# Altium project 724452_RPL-HX_Mobile_AEP_Rev0p91.PrjPcb (part 13 of 13)
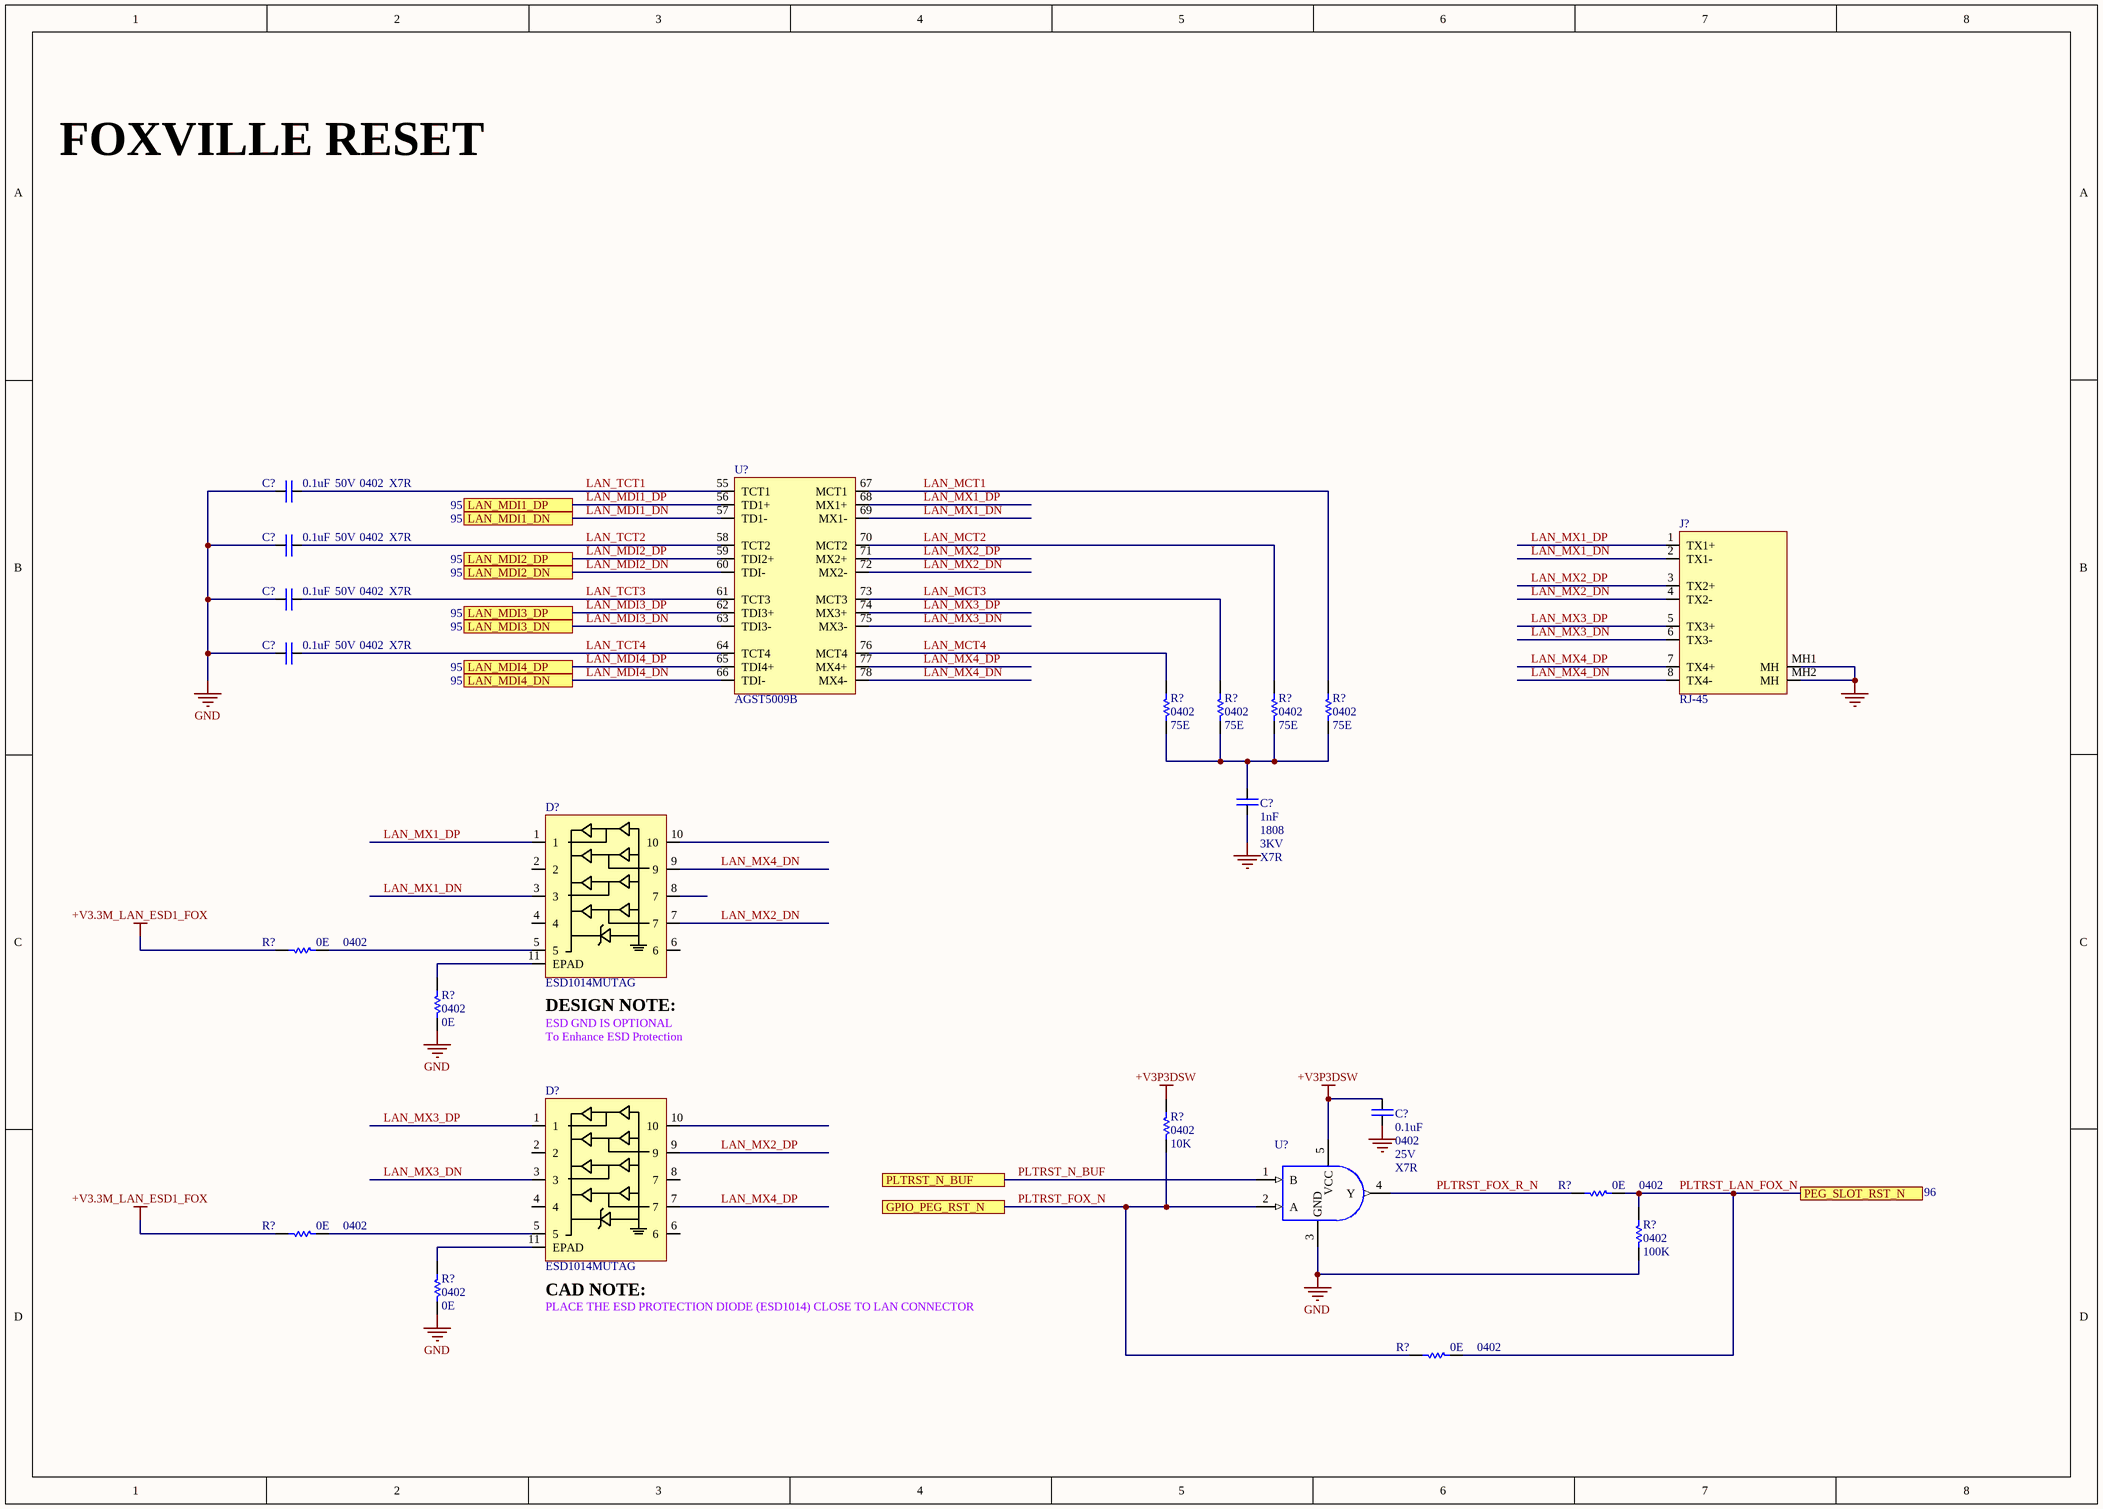
[diagram p163: 0096_CONNECTIVITY - FOX.SchDoc]

## Nets that join several sheets
+V1P8A: 0044_RPL PCH H GPIO OPT (R4409.2), 0045_PCH STRAPS 1 (R?#199.2), 0046_PCH STRAPS 2 (R?#206.2), 0049_GLITCH FREE CIRCUI (R?#235.2), 0059_CAMERA_CONNECTOR (10 pins), 0063_HDMI1_CONNECTOR (R?#341.2), 0093_M.2 KEY-E WLAN-BT (R?#382.2)
+V1P8S: 0047_PCH VALIDATION (R?#221.2 R?#229.2), 0054_eDP_CONNECTOR (Q?#1.1 R?#291.2)
+V3P3A: 0016_Processor - PM , C (R1610.2 R1611.1), 0029_System_debug_conne (R?#54.2 R?#55.2 R?#67.2), 0043_GPP_MUX_E (R?#167.2), 0044_RPL PCH H GPIO OPT (R4406.1), 0052_PCIe_X16 (R?#257.2), 0059_CAMERA_CONNECTOR (6 pins), 0062_HDMI0_CONNECTOR  (R?#312.2 R?#318.2), 0063_HDMI1_CONNECTOR (R?#335.2), 0074_S0IX_REQ_ACK_OPTIO (R7407.1), 0082_USB3 (FB5B1.2), 0084_USB3 (R8401.1 R22221.1), 0091_USB3 (FB9201.2), 0093_M.2 KEY-E WLAN-BT (R?#381.2 R?#386.2 R?#388.2)
+V3P3A_KBC: 0029_System_debug_conne (R?#65.2 R?#66.2), 0074_S0IX_REQ_ACK_OPTIO (R7402.1)
+V3P3DSW: 0029_System_debug_conne (R?#69.2), 0030_DEBUG_CARD_SPI_SIG (D?#2.A), 0044_RPL PCH H GPIO OPT (R?#174.2 R?#177.2), 0046_PCH STRAPS 2 (R?#208.2), 0058_DISPLAY SHIFT-POWE (C2B14.1 R1B3.2 U5801.3), 0095_GBIT LAN - FOXVILLE LAN PHY CHIP (R?#403.1), 0096_CONNECTIVITY - FOX (C?#273.1 R?#430.2 U?#10.5)
+V3P3S: 0034_PCH_CLOCK (6 pins), 0043_GPP_MUX_E (R?#166.2), 0044_RPL PCH H GPIO OPT (C4401.1 U4401.5), 0047_PCH VALIDATION (R?#223.2 R?#226.2), 0052_PCIe_X16 (R?#247.2 R?#249.2 R?#250.2 R?#251.2), 0054_eDP_CONNECTOR (R?#283.2 R?#286.2 R?#294.1 R?#299.2)
+V5A: 0058_DISPLAY SHIFT-POWE (R2A5.1), 0059_CAMERA_CONNECTOR (R5932.1), 0084_USB3 (C8401.1 U8401.4 U8401.5)
+V5A_DDR5: 0024_DDR5 SODIMM CONTRO (C?#80.1 J2301.1 J2301.3), 0026_DDR5 SODIMM CONTRO (7 pins)
+V5A_L: 0062_HDMI0_CONNECTOR  (R?#307.2), 0063_HDMI1_CONNECTOR (R?#330.2), 0084_USB3 (C22113.1 U8402.4 U8402.5)
+V5A_USB_P1: 0083_USB3 (FB8301.2), 0084_USB3 (U8402.1)
+V5A_USB_P2: 0084_USB3 (U8401.1), 0090_USB3 (FB9001.2)
+V5S: 0055_LED CON (C5501.1 R5505.1), 0059_CAMERA_CONNECTOR (R21052.1)
+VCC1P05_PROC: 0016_Processor - PM , C (8 pins), 0017_Processor - MISC (R?#38.2), 0029_System_debug_conne (C?#88.1 R?#62.1), 0031_DEBUG-XDP_SERIES_T (R?#93.2 R?#94.2 R?#95.2 R?#103.2), 0032_DEGUG-JTAG (R?#111.2 R?#112.2 R?#115.2 R?#116.2)
+VCC_CFG_PU_OUT: 0016_Processor - PM , C (6 pins), 0017_Processor - MISC (U?#1.N12), 0029_System_debug_conne (R?#63.2)
+VCC_MPHYPLL_1P8: 0041_PCH_PWR_GND (U?#4.AK22 U?#4.AK23 U?#4.AK25), 0042_PCH_PI_BOM (C7R9.1)
+VCCA_0P82: 0041_PCH_PWR_GND (6 pins), 0042_PCH_PI_BOM (C6R3.1 C6R7.1)
+VCCA_XTAL_PLL_1P8: 0041_PCH_PWR_GND (U?#4.AK16 U?#4.AK18 U?#4.AM16 U?#4.AM18), 0042_PCH_PI_BOM (C7P7.1 C7R5.1 C7R7.1)
+VCCCNVI_LDO_0P4: 0041_PCH_PWR_GND (7 pins), 0042_PCH_PI_BOM (C7E1.1)
+VCCDD2_PROC: 0024_DDR5 SODIMM CONTRO (R?#46.2 R?#48.2), 0026_DDR5 SODIMM CONTRO (R?#51.2)
+VCCDPHY_1P24: 0041_PCH_PWR_GND (U?#4.BF4), 0042_PCH_PI_BOM (C7R1.1)
+VCCHSIO_0P82: 0041_PCH_PWR_GND (30 pins), 0042_PCH_PI_BOM (C6F1.1 C6F2.1 C6F3.1 C7R10.1)
+VCCPDSW_3P3: 0017_Processor - MISC (R?#37.1), 0041_PCH_PWR_GND (U?#4.BE54 U?#4.BF54 U?#4.BF55 U?#4.BG55), 0042_PCH_PI_BOM (C7F1.1)
+VCCPGPPEFK_3P3_1P8_R: 0043_GPP_MUX_E (R?#159.2), 0052_PCIe_X16 (R?#274.2)
+VCCPRIM_1P05: 0041_PCH_PWR_GND (U?#4.AD15), 0042_PCH_PI_BOM (C7R2.1)
+VCCPRIM_1P8: 0041_PCH_PWR_GND (6 pins), 0042_PCH_PI_BOM (5 pins), 0045_PCH STRAPS 1 (R?#185.2), 0046_PCH STRAPS 2 (R?#212.2)
+VCCPRIM_3P3: 0030_DEBUG_CARD_SPI_SIG (R?#90.2), 0041_PCH_PWR_GND (5 pins), 0042_PCH_PI_BOM (C7R12.1 C7R13.1 C7R14.1 C7R15.1), 0043_GPP_MUX_E (R?#157.2 R?#162.2), 0044_RPL PCH H GPIO OPT (R?#176.2 R?#180.2 R?#182.2), 0045_PCH STRAPS 1 (7 pins), 0046_PCH STRAPS 2 (R?#209.2 R?#213.2 R?#216.2)
+VCCPRIMCORE_0P82: 0041_PCH_PWR_GND (13 pins), 0042_PCH_PI_BOM (C6R11.1 C7P8.1)
+VCCPRTC_3P3: 0041_PCH_PWR_GND (5 pins), 0042_PCH_PI_BOM (C7R18.1 C7R19.1)
+VCCRTCEXT: 0041_PCH_PWR_GND (U?#4.AV44), 0042_PCH_PI_BOM (C7F2.1)
+VPROG_3P3: 0029_System_debug_conne (R?#58.2), 0030_DEBUG_CARD_SPI_SIG (11 pins)
+VPROG_3P3_CONN: 0029_System_debug_conne (C?#91.1 J?#4.34), 0030_DEBUG_CARD_SPI_SIG (D?#1.A)
EXP_A_RX_4_DP: 0006_BLOCK DIAGRAM - PO (17 pins), 0012_Processor - PEG, D (U1401.B10 U1401.B12), 0016_Processor - PM , C (5 pins), 0017_Processor - MISC (5 pins), 0021_Processor PD BOM - (62 pins), 0022_Processor - CPU ST (104 pins), 0024_DDR5 SODIMM CONTRO (125 pins), 0026_DDR5 SODIMM CONTRO (129 pins), 0029_System_debug_conne (13 pins), 0030_DEBUG_CARD_SPI_SIG (8 pins), 0031_DEBUG-XDP_SERIES_T (5 pins), 0034_PCH_CLOCK (C?#96.1 C?#97.1 X?#1.2 X?#1.4), 0036_PCH_DMI (R?#151.1), 0037_PCH_PCIe_SATA (R?#152.2 R?#153.2), 0038_PCH_USB (R?#154.1 R?#155.1 R?#156.2), 0041_PCH_PWR_GND (361 pins), 0042_PCH_PI_BOM (28 pins), 0043_GPP_MUX_E (C?#98.2 C?#99.1 C?#100.2 R?#170.1), 0044_RPL PCH H GPIO OPT (8 pins), 0045_PCH STRAPS 1 (11 pins), 0046_PCH STRAPS 2 (6 pins), 0047_PCH VALIDATION (5 pins), 0049_GLITCH FREE CIRCUI (16 pins), 0052_PCIe_X16 (91 pins), 0053_PCIE GEN5_MISC (R?#278.1 SW?#2.4), 0054_eDP_CONNECTOR (28 pins), 0055_LED CON (C5501.2 J5501.2 J5501.MH1 J5501.MH2), 0058_DISPLAY SHIFT-POWE (11 pins), 0059_CAMERA_CONNECTOR (46 pins), 0062_HDMI0_CONNECTOR  (26 pins), 0063_HDMI1_CONNECTOR (28 pins), 0076_TBT_0_PA_CONNECTOR (40 pins), 0077_TBT_0_PB_CONNECTOR (40 pins), 0082_USB3 (22 pins), 0083_USB3 (16 pins), 0084_USB3 (C8401.2 C22113.2 U8401.2 U8402.2), 0090_USB3 (16 pins), 0091_USB3 (22 pins), 0093_M.2 KEY-E WLAN-BT (28 pins), 0095_GBIT LAN - FOXVILLE LAN PHY CHIP (38 pins), 0096_CONNECTIVITY - FOX (12 pins)
VCC: 0006_BLOCK DIAGRAM - PO (17 pins), 0045_PCH STRAPS 1 (R?#192.2), 0095_GBIT LAN - FOXVILLE LAN PHY CHIP (U?#8.8)
CLK_SRC_LAN_CTRL_DN: 0034_PCH_CLOCK (R?#132.2), 0095_GBIT LAN - FOXVILLE LAN PHY CHIP (C?#259.1)
CLK_SRC_LAN_CTRL_DP: 0034_PCH_CLOCK (R?#131.2), 0095_GBIT LAN - FOXVILLE LAN PHY CHIP (C?#258.1)
CLK_SRC_M.2_WLAN_DN: 0034_PCH_CLOCK (R?#135.2), 0093_M.2 KEY-E WLAN-BT (J?#11.49)
CLK_SRC_M.2_WLAN_DP: 0034_PCH_CLOCK (R?#134.2), 0093_M.2 KEY-E WLAN-BT (J?#11.47)
CLK_SRC_PEG_SLOT_DN: 0034_PCH_CLOCK (R?#120.2), 0052_PCIe_X16 (J?#5.A14)
CLK_SRC_PEG_SLOT_DP: 0034_PCH_CLOCK (R?#119.2), 0052_PCIe_X16 (J?#5.A13)
CNV_MFUART2_RXD: 0040_GPP_I_J_K_R_S (U23601.AV12), 0093_M.2 KEY-E WLAN-BT (R?#398.1)
CNV_MFUART2_TXD: 0040_GPP_I_J_K_R_S (U23601.BB4), 0093_M.2 KEY-E WLAN-BT (R?#396.1)
CNV_PA_BLANKING: 0040_GPP_I_J_K_R_S (U23601.BB2), 0093_M.2 KEY-E WLAN-BT (R?#394.1)
CNV_RF_RST_1P8_N: 0039_GPP_C_D_E (U23601.AK4), 0093_M.2 KEY-E WLAN-BT (R?#391.2)
CNV_WR_0_DN: 0036_PCH_DMI (U23601.AW21), 0093_M.2 KEY-E WLAN-BT (R?#377.1)
CNV_WR_0_DP: 0036_PCH_DMI (U23601.BA21), 0093_M.2 KEY-E WLAN-BT (R?#378.1)
CNV_WR_1_DN: 0036_PCH_DMI (U23601.BB18), 0093_M.2 KEY-E WLAN-BT (R?#373.1)
CNV_WR_1_DP: 0036_PCH_DMI (U23601.BD17), 0093_M.2 KEY-E WLAN-BT (R?#375.1)
CNV_WR_CLK_DN: 0036_PCH_DMI (U23601.AW19), 0093_M.2 KEY-E WLAN-BT (R?#379.1)
CNV_WR_CLK_DP: 0036_PCH_DMI (U23601.BA18), 0093_M.2 KEY-E WLAN-BT (R?#380.1)
CNV_WT_0_DN: 0036_PCH_DMI (U23601.BF18), 0093_M.2 KEY-E WLAN-BT (J?#11.67)
CNV_WT_0_DP: 0036_PCH_DMI (U23601.BG18), 0093_M.2 KEY-E WLAN-BT (J?#11.65)
CNV_WT_1_DN: 0036_PCH_DMI (U23601.BF19), 0093_M.2 KEY-E WLAN-BT (J?#11.61)
CNV_WT_1_DP: 0036_PCH_DMI (U23601.BE19), 0093_M.2 KEY-E WLAN-BT (J?#11.59)
CNV_WT_CLK_DN: 0036_PCH_DMI (U23601.BF17), 0093_M.2 KEY-E WLAN-BT (J?#11.73)
CNV_WT_CLK_DP: 0036_PCH_DMI (U23601.BG17), 0093_M.2 KEY-E WLAN-BT (J?#11.71)
CNVI_CLKREQ_1P8_N: 0039_GPP_C_D_E (U23601.AJ2), 0093_M.2 KEY-E WLAN-BT (R?#392.2)
CPU_RTCCLK: 0017_Processor - MISC (R?#41.2 R?#42.2 U?#1.N8), 0034_PCH_CLOCK (R?#150.2)
DDIA_AUX_DN: 0013_Processor - DISPLA (U1401.D35), 0054_eDP_CONNECTOR (C?#159.2 R?#303.2)
DDIA_AUX_DP: 0013_Processor - DISPLA (U1401.E35), 0054_eDP_CONNECTOR (C?#157.2 R?#302.2)
DDIA_TX0_DN: 0013_Processor - DISPLA (U1401.E34), 0054_eDP_CONNECTOR (C?#162.2)
DDIA_TX0_DP: 0013_Processor - DISPLA (U1401.F34), 0054_eDP_CONNECTOR (C?#161.2)
DDIA_TX1_DN: 0013_Processor - DISPLA (U1401.D33), 0054_eDP_CONNECTOR (C?#160.2)
DDIA_TX1_DP: 0013_Processor - DISPLA (U1401.E33), 0054_eDP_CONNECTOR (C?#158.2)
DDIA_TX2_DN: 0013_Processor - DISPLA (U1401.E32), 0054_eDP_CONNECTOR (C?#156.2)
DDIA_TX2_DP: 0013_Processor - DISPLA (U1401.F32), 0054_eDP_CONNECTOR (C?#155.2)
DDIA_TX3_DN: 0013_Processor - DISPLA (U1401.D31), 0054_eDP_CONNECTOR (C?#154.2)
DDIA_TX3_DP: 0013_Processor - DISPLA (U1401.E31), 0054_eDP_CONNECTOR (C?#153.2)
DDID_TX0_DN: 0013_Processor - DISPLA (U1401.B39), 0063_HDMI1_CONNECTOR (C?#191.1)
DDID_TX0_DP: 0013_Processor - DISPLA (U1401.A39), 0063_HDMI1_CONNECTOR (C?#190.1)
DDID_TX1_DN: 0013_Processor - DISPLA (U1401.C38), 0063_HDMI1_CONNECTOR (C?#189.1)
DDID_TX1_DP: 0013_Processor - DISPLA (U1401.B38), 0063_HDMI1_CONNECTOR (C?#188.1)
DDID_TX2_DN: 0013_Processor - DISPLA (U1401.B37), 0063_HDMI1_CONNECTOR (C?#187.1)
DDID_TX2_DP: 0013_Processor - DISPLA (U1401.A37), 0063_HDMI1_CONNECTOR (C?#186.1)
DDID_TX3_DN: 0013_Processor - DISPLA (U1401.C36), 0063_HDMI1_CONNECTOR (C?#194.1)
DDID_TX3_DP: 0013_Processor - DISPLA (U1401.B36), 0063_HDMI1_CONNECTOR (C?#192.1)
DDIE_TX0_DN: 0013_Processor - DISPLA (U1401.H36), 0062_HDMI0_CONNECTOR  (C?#175.1)
DDIE_TX0_DP: 0013_Processor - DISPLA (U1401.J36), 0062_HDMI0_CONNECTOR  (C?#174.1)
DDIE_TX1_DN: 0013_Processor - DISPLA (U1401.G35), 0062_HDMI0_CONNECTOR  (C?#173.1)
DDIE_TX1_DP: 0013_Processor - DISPLA (U1401.H35), 0062_HDMI0_CONNECTOR  (C?#172.1)
DDIE_TX2_DN: 0013_Processor - DISPLA (U1401.H34), 0062_HDMI0_CONNECTOR  (C?#171.1)
DDIE_TX2_DP: 0013_Processor - DISPLA (U1401.J34), 0062_HDMI0_CONNECTOR  (C?#170.1)
DDIE_TX3_DN: 0013_Processor - DISPLA (U1401.G33), 0062_HDMI0_CONNECTOR  (C?#177.1)
DDIE_TX3_DP: 0013_Processor - DISPLA (U1401.H33), 0062_HDMI0_CONNECTOR  (C?#176.1)
DDR5_C0_0_CA0: 0014_Processor - MEMORY (U1401.BC36), 0024_DDR5 SODIMM CONTRO (J2301.107)
DDR5_C0_0_CA1: 0014_Processor - MEMORY (U1401.BF36), 0024_DDR5 SODIMM CONTRO (J2301.109)
DDR5_C0_0_CA2: 0014_Processor - MEMORY (U1401.BE36), 0024_DDR5 SODIMM CONTRO (J2301.113)
DDR5_C0_0_CA3: 0014_Processor - MEMORY (U1401.BE35), 0024_DDR5 SODIMM CONTRO (J2301.114)
DDR5_C0_0_CA4: 0014_Processor - MEMORY (U1401.BD35), 0024_DDR5 SODIMM CONTRO (J2301.115)
DDR5_C0_0_CA5: 0014_Processor - MEMORY (U1401.BC34), 0024_DDR5 SODIMM CONTRO (J2301.116)
DDR5_C0_0_CA6: 0014_Processor - MEMORY (U1401.BF34), 0024_DDR5 SODIMM CONTRO (J2301.119)
DDR5_C0_0_CA7: 0014_Processor - MEMORY (U1401.BE34), 0024_DDR5 SODIMM CONTRO (J2301.120)
DDR5_C0_0_CA8: 0014_Processor - MEMORY (U1401.BE33), 0024_DDR5 SODIMM CONTRO (J2301.121)
DDR5_C0_0_CA9: 0014_Processor - MEMORY (U1401.BD33), 0024_DDR5 SODIMM CONTRO (J2301.122)
DDR5_C0_0_CA10: 0014_Processor - MEMORY (U1401.BC32), 0024_DDR5 SODIMM CONTRO (J2301.125)
DDR5_C0_0_CA11: 0014_Processor - MEMORY (U1401.BF32), 0024_DDR5 SODIMM CONTRO (J2301.126)
DDR5_C0_0_CA12: 0014_Processor - MEMORY (U1401.BE32), 0024_DDR5 SODIMM CONTRO (J2301.127)
DDR5_C0_0_CK2_DN: 0014_Processor - MEMORY (U1401.AV32), 0024_DDR5 SODIMM CONTRO (J2301.133)
DDR5_C0_0_CK2_DP: 0014_Processor - MEMORY (U1401.AU32), 0024_DDR5 SODIMM CONTRO (J2301.131)
DDR5_C0_0_CK3_DN: 0014_Processor - MEMORY (U1401.AU31), 0024_DDR5 SODIMM CONTRO (J2301.134)
DDR5_C0_0_CK3_DP: 0014_Processor - MEMORY (U1401.AT31), 0024_DDR5 SODIMM CONTRO (J2301.132)
DDR5_C0_0_CS2_N: 0014_Processor - MEMORY (U1401.BE38), 0024_DDR5 SODIMM CONTRO (J2301.106)
DDR5_C0_0_CS3_N: 0014_Processor - MEMORY (U1401.BC38), 0024_DDR5 SODIMM CONTRO (J2301.110)
DDR5_C0_0_DQ0_0: 0014_Processor - MEMORY (U1401.AM51), 0024_DDR5 SODIMM CONTRO (J2301.11)
DDR5_C0_0_DQ0_1: 0014_Processor - MEMORY (U1401.AM52), 0024_DDR5 SODIMM CONTRO (J2301.12)
DDR5_C0_0_DQ0_2: 0014_Processor - MEMORY (U1401.AM53), 0024_DDR5 SODIMM CONTRO (J2301.15)
DDR5_C0_0_DQ0_3: 0014_Processor - MEMORY (U1401.AN53), 0024_DDR5 SODIMM CONTRO (J2301.16)
DDR5_C0_0_DQ0_4: 0014_Processor - MEMORY (U1401.AP53), 0024_DDR5 SODIMM CONTRO (J2301.23)
DDR5_C0_0_DQ0_5: 0014_Processor - MEMORY (U1401.AR52), 0024_DDR5 SODIMM CONTRO (J2301.26)
DDR5_C0_0_DQ0_6: 0014_Processor - MEMORY (U1401.AR53), 0024_DDR5 SODIMM CONTRO (J2301.27)
DDR5_C0_0_DQ0_7: 0014_Processor - MEMORY (U1401.AR51), 0024_DDR5 SODIMM CONTRO (J2301.30)
DDR5_C0_0_DQ1_0: 0014_Processor - MEMORY (U1401.AU51), 0024_DDR5 SODIMM CONTRO (J2301.31)
DDR5_C0_0_DQ1_1: 0014_Processor - MEMORY (U1401.AU53), 0024_DDR5 SODIMM CONTRO (J2301.34)
DDR5_C0_0_DQ1_2: 0014_Processor - MEMORY (U1401.AV53), 0024_DDR5 SODIMM CONTRO (J2301.35)
DDR5_C0_0_DQ1_3: 0014_Processor - MEMORY (U1401.AU52), 0024_DDR5 SODIMM CONTRO (J2301.38)
DDR5_C0_0_DQ1_4: 0014_Processor - MEMORY (U1401.AW53), 0024_DDR5 SODIMM CONTRO (J2301.45)
DDR5_C0_0_DQ1_5: 0014_Processor - MEMORY (U1401.AY51), 0024_DDR5 SODIMM CONTRO (J2301.46)
DDR5_C0_0_DQ1_6: 0014_Processor - MEMORY (U1401.AY53), 0024_DDR5 SODIMM CONTRO (J2301.49)
DDR5_C0_0_DQ1_7: 0014_Processor - MEMORY (U1401.AY52), 0024_DDR5 SODIMM CONTRO (J2301.50)
DDR5_C0_0_DQ2_0: 0014_Processor - MEMORY (U1401.BB54), 0024_DDR5 SODIMM CONTRO (J2301.53)
DDR5_C0_0_DQ2_1: 0014_Processor - MEMORY (U1401.BB53), 0024_DDR5 SODIMM CONTRO (J2301.54)
DDR5_C0_0_DQ2_2: 0014_Processor - MEMORY (U1401.BB52), 0024_DDR5 SODIMM CONTRO (J2301.57)
DDR5_C0_0_DQ2_3: 0014_Processor - MEMORY (U1401.BB51), 0024_DDR5 SODIMM CONTRO (J2301.58)
DDR5_C0_0_DQ2_4: 0014_Processor - MEMORY (U1401.BE50), 0024_DDR5 SODIMM CONTRO (J2301.65)
DDR5_C0_0_DQ2_5: 0014_Processor - MEMORY (U1401.BC50), 0024_DDR5 SODIMM CONTRO (J2301.68)
DDR5_C0_0_DQ2_6: 0014_Processor - MEMORY (U1401.BF50), 0024_DDR5 SODIMM CONTRO (J2301.69)
DDR5_C0_0_DQ2_7: 0014_Processor - MEMORY (U1401.BD50), 0024_DDR5 SODIMM CONTRO (J2301.72)
DDR5_C0_0_DQ3_0: 0014_Processor - MEMORY (U1401.BD48), 0024_DDR5 SODIMM CONTRO (J2301.73)
DDR5_C0_0_DQ3_1: 0014_Processor - MEMORY (U1401.BE48), 0024_DDR5 SODIMM CONTRO (J2301.76)
DDR5_C0_0_DQ3_2: 0014_Processor - MEMORY (U1401.BC48), 0024_DDR5 SODIMM CONTRO (J2301.77)
DDR5_C0_0_DQ3_3: 0014_Processor - MEMORY (U1401.BE47), 0024_DDR5 SODIMM CONTRO (J2301.80)
DDR5_C0_0_DQ3_4: 0014_Processor - MEMORY (U1401.BE46), 0024_DDR5 SODIMM CONTRO (J2301.87)
DDR5_C0_0_DQ3_5: 0014_Processor - MEMORY (U1401.BE45), 0024_DDR5 SODIMM CONTRO (J2301.88)
DDR5_C0_0_DQ3_6: 0014_Processor - MEMORY (U1401.BD45), 0024_DDR5 SODIMM CONTRO (J2301.91)
DDR5_C0_0_DQ3_7: 0014_Processor - MEMORY (U1401.BC45), 0024_DDR5 SODIMM CONTRO (J2301.92)
DDR5_C0_0_DQ4_0: 0014_Processor - MEMORY (U1401.BE43), 0024_DDR5 SODIMM CONTRO (J2301.95)
DDR5_C0_0_DQ4_1: 0014_Processor - MEMORY (U1401.BD43), 0024_DDR5 SODIMM CONTRO (J2301.96)
DDR5_C0_0_DQ4_2: 0014_Processor - MEMORY (U1401.BE42), 0024_DDR5 SODIMM CONTRO (J2301.99)
DDR5_C0_0_DQ4_3: 0014_Processor - MEMORY (U1401.BC43), 0024_DDR5 SODIMM CONTRO (J2301.103)
DDR5_C0_0_DQS0_DN: 0014_Processor - MEMORY (U1401.AN51), 0024_DDR5 SODIMM CONTRO (J2301.20)
DDR5_C0_0_DQS0_DP: 0014_Processor - MEMORY (U1401.AP51), 0024_DDR5 SODIMM CONTRO (J2301.22)
DDR5_C0_0_DQS1_DN: 0014_Processor - MEMORY (U1401.AV51), 0024_DDR5 SODIMM CONTRO (J2301.39)
DDR5_C0_0_DQS1_DP: 0014_Processor - MEMORY (U1401.AW51), 0024_DDR5 SODIMM CONTRO (J2301.41)
DDR5_C0_0_DQS2_DN: 0014_Processor - MEMORY (U1401.BD52), 0024_DDR5 SODIMM CONTRO (J2301.62)
DDR5_C0_0_DQS2_DP: 0014_Processor - MEMORY (U1401.BD51), 0024_DDR5 SODIMM CONTRO (J2301.64)
DDR5_C0_0_DQS3_DN: 0014_Processor - MEMORY (U1401.BC47), 0024_DDR5 SODIMM CONTRO (J2301.81)
DDR5_C0_0_DQS3_DP: 0014_Processor - MEMORY (U1401.BC46), 0024_DDR5 SODIMM CONTRO (J2301.83)
DDR5_C0_0_DQS4_DN: 0014_Processor - MEMORY (U1401.BC42), 0024_DDR5 SODIMM CONTRO (J2301.100)
DDR5_C0_0_DQS4_DP: 0014_Processor - MEMORY (U1401.BC41), 0024_DDR5 SODIMM CONTRO (J2301.102)
DDR5_C0_1_CA0: 0014_Processor - MEMORY (U1401.BD17), 0024_DDR5 SODIMM CONTRO (J2301.164)
DDR5_C0_1_CA1: 0014_Processor - MEMORY (U1401.BE17), 0024_DDR5 SODIMM CONTRO (J2301.162)
DDR5_C0_1_CA2: 0014_Processor - MEMORY (U1401.BE18), 0024_DDR5 SODIMM CONTRO (J2301.158)
DDR5_C0_1_CA3: 0014_Processor - MEMORY (U1401.BF18), 0024_DDR5 SODIMM CONTRO (J2301.157)
DDR5_C0_1_CA4: 0014_Processor - MEMORY (U1401.BC19), 0024_DDR5 SODIMM CONTRO (J2301.156)
DDR5_C0_1_CA5: 0014_Processor - MEMORY (U1401.BD19), 0024_DDR5 SODIMM CONTRO (J2301.155)
DDR5_C0_1_CA6: 0014_Processor - MEMORY (U1401.BE19), 0024_DDR5 SODIMM CONTRO (J2301.152)
DDR5_C0_1_CA7: 0014_Processor - MEMORY (U1401.BE20), 0024_DDR5 SODIMM CONTRO (J2301.151)
DDR5_C0_1_CA8: 0014_Processor - MEMORY (U1401.BF20), 0024_DDR5 SODIMM CONTRO (J2301.150)
DDR5_C0_1_CA9: 0014_Processor - MEMORY (U1401.BC21), 0024_DDR5 SODIMM CONTRO (J2301.149)
DDR5_C0_1_CA10: 0014_Processor - MEMORY (U1401.BD21), 0024_DDR5 SODIMM CONTRO (J2301.146)
DDR5_C0_1_CA11: 0014_Processor - MEMORY (U1401.BE21), 0024_DDR5 SODIMM CONTRO (J2301.145)
DDR5_C0_1_CA12: 0014_Processor - MEMORY (U1401.BE22), 0024_DDR5 SODIMM CONTRO (J2301.144)
DDR5_C0_1_CK2_DN: 0014_Processor - MEMORY (U1401.AV24), 0024_DDR5 SODIMM CONTRO (J2301.139)
DDR5_C0_1_CK2_DP: 0014_Processor - MEMORY (U1401.AU24), 0024_DDR5 SODIMM CONTRO (J2301.137)
DDR5_C0_1_CK3_DN: 0014_Processor - MEMORY (U1401.AU25), 0024_DDR5 SODIMM CONTRO (J2301.140)
DDR5_C0_1_CK3_DP: 0014_Processor - MEMORY (U1401.AT25), 0024_DDR5 SODIMM CONTRO (J2301.138)
DDR5_C0_1_CS2_N: 0014_Processor - MEMORY (U1401.BE16), 0024_DDR5 SODIMM CONTRO (J2301.161)
DDR5_C0_1_CS3_N: 0014_Processor - MEMORY (U1401.BC16), 0024_DDR5 SODIMM CONTRO (J2301.165)
DDR5_C0_1_DQ0_0: 0014_Processor - MEMORY (U1401.BC11), 0024_DDR5 SODIMM CONTRO (J2301.179)
DDR5_C0_1_DQ0_1: 0014_Processor - MEMORY (U1401.BE11), 0024_DDR5 SODIMM CONTRO (J2301.180)
DDR5_C0_1_DQ0_2: 0014_Processor - MEMORY (U1401.BE10), 0024_DDR5 SODIMM CONTRO (J2301.183)
DDR5_C0_1_DQ0_3: 0014_Processor - MEMORY (U1401.BD11), 0024_DDR5 SODIMM CONTRO (J2301.184)
DDR5_C0_1_DQ0_4: 0014_Processor - MEMORY (U1401.BC8), 0024_DDR5 SODIMM CONTRO (J2301.191)
DDR5_C0_1_DQ0_5: 0014_Processor - MEMORY (U1401.BE8), 0024_DDR5 SODIMM CONTRO (J2301.194)
DDR5_C0_1_DQ0_6: 0014_Processor - MEMORY (U1401.BD8), 0024_DDR5 SODIMM CONTRO (J2301.195)
DDR5_C0_1_DQ0_7: 0014_Processor - MEMORY (U1401.BE9), 0024_DDR5 SODIMM CONTRO (J2301.198)
DDR5_C0_1_DQ1_0: 0014_Processor - MEMORY (U1401.BF6), 0024_DDR5 SODIMM CONTRO (J2301.199)
DDR5_C0_1_DQ1_1: 0014_Processor - MEMORY (U1401.BE6), 0024_DDR5 SODIMM CONTRO (J2301.202)
DDR5_C0_1_DQ1_2: 0014_Processor - MEMORY (U1401.BD6), 0024_DDR5 SODIMM CONTRO (J2301.203)
DDR5_C0_1_DQ1_3: 0014_Processor - MEMORY (U1401.BC6), 0024_DDR5 SODIMM CONTRO (J2301.206)
DDR5_C0_1_DQ1_4: 0014_Processor - MEMORY (U1401.BC5), 0024_DDR5 SODIMM CONTRO (J2301.213)
DDR5_C0_1_DQ1_5: 0014_Processor - MEMORY (U1401.BC2), 0024_DDR5 SODIMM CONTRO (J2301.214)
DDR5_C0_1_DQ1_6: 0014_Processor - MEMORY (U1401.BC4), 0024_DDR5 SODIMM CONTRO (J2301.217)
DDR5_C0_1_DQ1_7: 0014_Processor - MEMORY (U1401.BC3), 0024_DDR5 SODIMM CONTRO (J2301.218)
DDR5_C0_1_DQ2_0: 0014_Processor - MEMORY (U1401.BA2), 0024_DDR5 SODIMM CONTRO (J2301.221)
DDR5_C0_1_DQ2_1: 0014_Processor - MEMORY (U1401.BA3), 0024_DDR5 SODIMM CONTRO (J2301.222)
DDR5_C0_1_DQ2_2: 0014_Processor - MEMORY (U1401.AY2), 0024_DDR5 SODIMM CONTRO (J2301.225)
DDR5_C0_1_DQ2_3: 0014_Processor - MEMORY (U1401.BA4), 0024_DDR5 SODIMM CONTRO (J2301.226)
DDR5_C0_1_DQ2_4: 0014_Processor - MEMORY (U1401.AV2), 0024_DDR5 SODIMM CONTRO (J2301.233)
DDR5_C0_1_DQ2_5: 0014_Processor - MEMORY (U1401.AV3), 0024_DDR5 SODIMM CONTRO (J2301.236)
DDR5_C0_1_DQ2_6: 0014_Processor - MEMORY (U1401.AV4), 0024_DDR5 SODIMM CONTRO (J2301.237)
DDR5_C0_1_DQ2_7: 0014_Processor - MEMORY (U1401.AW2), 0024_DDR5 SODIMM CONTRO (J2301.240)
DDR5_C0_1_DQ3_0: 0014_Processor - MEMORY (U1401.AT2), 0024_DDR5 SODIMM CONTRO (J2301.241)
DDR5_C0_1_DQ3_1: 0014_Processor - MEMORY (U1401.AT3), 0024_DDR5 SODIMM CONTRO (J2301.244)
DDR5_C0_1_DQ3_2: 0014_Processor - MEMORY (U1401.AR2), 0024_DDR5 SODIMM CONTRO (J2301.245)
DDR5_C0_1_DQ3_3: 0014_Processor - MEMORY (U1401.AT4), 0024_DDR5 SODIMM CONTRO (J2301.248)
DDR5_C0_1_DQ3_4: 0014_Processor - MEMORY (U1401.AN2), 0024_DDR5 SODIMM CONTRO (J2301.255)
DDR5_C0_1_DQ3_5: 0014_Processor - MEMORY (U1401.AN3), 0024_DDR5 SODIMM CONTRO (J2301.256)
DDR5_C0_1_DQ3_6: 0014_Processor - MEMORY (U1401.AN4), 0024_DDR5 SODIMM CONTRO (J2301.259)
DDR5_C0_1_DQ3_7: 0014_Processor - MEMORY (U1401.AP2), 0024_DDR5 SODIMM CONTRO (J2301.260)
DDR5_C0_1_DQ4_0: 0014_Processor - MEMORY (U1401.BE13), 0024_DDR5 SODIMM CONTRO (J2301.168)
DDR5_C0_1_DQ4_1: 0014_Processor - MEMORY (U1401.BE14), 0024_DDR5 SODIMM CONTRO (J2301.172)
DDR5_C0_1_DQ4_2: 0014_Processor - MEMORY (U1401.BD13), 0024_DDR5 SODIMM CONTRO (J2301.176)
DDR5_C0_1_DQ4_3: 0014_Processor - MEMORY (U1401.BF14), 0024_DDR5 SODIMM CONTRO (J2301.175)
DDR5_C0_1_DQS0_DN: 0014_Processor - MEMORY (U1401.BC10), 0024_DDR5 SODIMM CONTRO (J2301.188)
DDR5_C0_1_DQS0_DP: 0014_Processor - MEMORY (U1401.BC9), 0024_DDR5 SODIMM CONTRO (J2301.190)
DDR5_C0_1_DQS1_DN: 0014_Processor - MEMORY (U1401.BE5), 0024_DDR5 SODIMM CONTRO (J2301.207)
DDR5_C0_1_DQS1_DP: 0014_Processor - MEMORY (U1401.BE4), 0024_DDR5 SODIMM CONTRO (J2301.209)
DDR5_C0_1_DQS2_DN: 0014_Processor - MEMORY (U1401.AY4), 0024_DDR5 SODIMM CONTRO (J2301.230)
DDR5_C0_1_DQS2_DP: 0014_Processor - MEMORY (U1401.AW4), 0024_DDR5 SODIMM CONTRO (J2301.232)
DDR5_C0_1_DQS3_DN: 0014_Processor - MEMORY (U1401.AR4), 0024_DDR5 SODIMM CONTRO (J2301.249)
DDR5_C0_1_DQS3_DP: 0014_Processor - MEMORY (U1401.AP4), 0024_DDR5 SODIMM CONTRO (J2301.251)
DDR5_C0_1_DQS4_DN: 0014_Processor - MEMORY (U1401.BC13), 0024_DDR5 SODIMM CONTRO (J2301.169)
DDR5_C0_1_DQS4_DP: 0014_Processor - MEMORY (U1401.BC14), 0024_DDR5 SODIMM CONTRO (J2301.171)
DDR5_C0_ALERT_N: 0014_Processor - MEMORY (U1401.AT26), 0024_DDR5 SODIMM CONTRO (R?#47.2)
DDR5_C1_0_CA0: 0015_Processor - MEMORY (U1401.AW32), 0026_DDR5 SODIMM CONTRO (J?#1.107)
DDR5_C1_0_CA1: 0015_Processor - MEMORY (U1401.BA33), 0026_DDR5 SODIMM CONTRO (J?#1.109)
DDR5_C1_0_CA2: 0015_Processor - MEMORY (U1401.BA32), 0026_DDR5 SODIMM CONTRO (J?#1.113)
DDR5_C1_0_CA3: 0015_Processor - MEMORY (U1401.AW31), 0026_DDR5 SODIMM CONTRO (J?#1.114)
DDR5_C1_0_CA4: 0015_Processor - MEMORY (U1401.AY31), 0026_DDR5 SODIMM CONTRO (J?#1.115)
DDR5_C1_0_CA5: 0015_Processor - MEMORY (U1401.AW30), 0026_DDR5 SODIMM CONTRO (J?#1.116)
DDR5_C1_0_CA6: 0015_Processor - MEMORY (U1401.BA31), 0026_DDR5 SODIMM CONTRO (J?#1.119)
DDR5_C1_0_CA7: 0015_Processor - MEMORY (U1401.BA30), 0026_DDR5 SODIMM CONTRO (J?#1.120)
DDR5_C1_0_CA8: 0015_Processor - MEMORY (U1401.AY29), 0026_DDR5 SODIMM CONTRO (J?#1.121)
DDR5_C1_0_CA9: 0015_Processor - MEMORY (U1401.AW29), 0026_DDR5 SODIMM CONTRO (J?#1.122)
DDR5_C1_0_CA10: 0015_Processor - MEMORY (U1401.AW28), 0026_DDR5 SODIMM CONTRO (J?#1.125)
DDR5_C1_0_CA11: 0015_Processor - MEMORY (U1401.BA29), 0026_DDR5 SODIMM CONTRO (J?#1.126)
DDR5_C1_0_CA12: 0015_Processor - MEMORY (U1401.BA28), 0026_DDR5 SODIMM CONTRO (J?#1.127)
DDR5_C1_0_CK2_DN: 0015_Processor - MEMORY (U1401.AV34), 0026_DDR5 SODIMM CONTRO (J?#1.133)
DDR5_C1_0_CK2_DP: 0015_Processor - MEMORY (U1401.AU34), 0026_DDR5 SODIMM CONTRO (J?#1.131)
DDR5_C1_0_CK3_DN: 0015_Processor - MEMORY (U1401.AT34), 0026_DDR5 SODIMM CONTRO (J?#1.134)
DDR5_C1_0_CK3_DP: 0015_Processor - MEMORY (U1401.AT33), 0026_DDR5 SODIMM CONTRO (J?#1.132)
DDR5_C1_0_CS2_N: 0015_Processor - MEMORY (U1401.BA34), 0026_DDR5 SODIMM CONTRO (J?#1.106)
DDR5_C1_0_CS3_N: 0015_Processor - MEMORY (U1401.AY35), 0026_DDR5 SODIMM CONTRO (J?#1.110)
DDR5_C1_0_DQ0_0: 0015_Processor - MEMORY (U1401.AL49), 0026_DDR5 SODIMM CONTRO (J?#1.12)
DDR5_C1_0_DQ0_1: 0015_Processor - MEMORY (U1401.AK49), 0026_DDR5 SODIMM CONTRO (J?#1.11)
DDR5_C1_0_DQ0_2: 0015_Processor - MEMORY (U1401.AK47), 0026_DDR5 SODIMM CONTRO (J?#1.16)
DDR5_C1_0_DQ0_3: 0015_Processor - MEMORY (U1401.AK48), 0026_DDR5 SODIMM CONTRO (J?#1.15)
DDR5_C1_0_DQ0_4: 0015_Processor - MEMORY (U1401.AM49), 0026_DDR5 SODIMM CONTRO (J?#1.26)
DDR5_C1_0_DQ0_5: 0015_Processor - MEMORY (U1401.AN47), 0026_DDR5 SODIMM CONTRO (J?#1.23)
DDR5_C1_0_DQ0_6: 0015_Processor - MEMORY (U1401.AN49), 0026_DDR5 SODIMM CONTRO (J?#1.30)
DDR5_C1_0_DQ0_7: 0015_Processor - MEMORY (U1401.AN48), 0026_DDR5 SODIMM CONTRO (J?#1.27)
DDR5_C1_0_DQ1_0: 0015_Processor - MEMORY (U1401.AR47), 0026_DDR5 SODIMM CONTRO (J?#1.34)
DDR5_C1_0_DQ1_1: 0015_Processor - MEMORY (U1401.AR49), 0026_DDR5 SODIMM CONTRO (J?#1.31)
DDR5_C1_0_DQ1_2: 0015_Processor - MEMORY (U1401.AT49), 0026_DDR5 SODIMM CONTRO (J?#1.38)
DDR5_C1_0_DQ1_3: 0015_Processor - MEMORY (U1401.AR48), 0026_DDR5 SODIMM CONTRO (J?#1.35)
DDR5_C1_0_DQ1_4: 0015_Processor - MEMORY (U1401.AU48), 0026_DDR5 SODIMM CONTRO (J?#1.46)
DDR5_C1_0_DQ1_5: 0015_Processor - MEMORY (U1401.AU46), 0026_DDR5 SODIMM CONTRO (J?#1.45)
DDR5_C1_0_DQ1_6: 0015_Processor - MEMORY (U1401.AU49), 0026_DDR5 SODIMM CONTRO (J?#1.50)
DDR5_C1_0_DQ1_7: 0015_Processor - MEMORY (U1401.AU47), 0026_DDR5 SODIMM CONTRO (J?#1.49)
DDR5_C1_0_DQ2_0: 0015_Processor - MEMORY (U1401.AW46), 0026_DDR5 SODIMM CONTRO (J?#1.54)
DDR5_C1_0_DQ2_1: 0015_Processor - MEMORY (U1401.BA49), 0026_DDR5 SODIMM CONTRO (J?#1.53)
DDR5_C1_0_DQ2_2: 0015_Processor - MEMORY (U1401.AW49), 0026_DDR5 SODIMM CONTRO (J?#1.58)
DDR5_C1_0_DQ2_3: 0015_Processor - MEMORY (U1401.AY49), 0026_DDR5 SODIMM CONTRO (J?#1.57)
DDR5_C1_0_DQ2_4: 0015_Processor - MEMORY (U1401.BA47), 0026_DDR5 SODIMM CONTRO (J?#1.68)
DDR5_C1_0_DQ2_5: 0015_Processor - MEMORY (U1401.AY46), 0026_DDR5 SODIMM CONTRO (J?#1.65)
DDR5_C1_0_DQ2_6: 0015_Processor - MEMORY (U1401.BA48), 0026_DDR5 SODIMM CONTRO (J?#1.72)
DDR5_C1_0_DQ2_7: 0015_Processor - MEMORY (U1401.BA46), 0026_DDR5 SODIMM CONTRO (J?#1.69)
DDR5_C1_0_DQ3_0: 0015_Processor - MEMORY (U1401.AW44), 0026_DDR5 SODIMM CONTRO (J?#1.76)
DDR5_C1_0_DQ3_1: 0015_Processor - MEMORY (U1401.BA44), 0026_DDR5 SODIMM CONTRO (J?#1.73)
DDR5_C1_0_DQ3_2: 0015_Processor - MEMORY (U1401.AY44), 0026_DDR5 SODIMM CONTRO (J?#1.80)
DDR5_C1_0_DQ3_3: 0015_Processor - MEMORY (U1401.BA43), 0026_DDR5 SODIMM CONTRO (J?#1.77)
DDR5_C1_0_DQ3_4: 0015_Processor - MEMORY (U1401.BA42), 0026_DDR5 SODIMM CONTRO (J?#1.88)
DDR5_C1_0_DQ3_5: 0015_Processor - MEMORY (U1401.BA41), 0026_DDR5 SODIMM CONTRO (J?#1.87)
DDR5_C1_0_DQ3_6: 0015_Processor - MEMORY (U1401.AY41), 0026_DDR5 SODIMM CONTRO (J?#1.92)
DDR5_C1_0_DQ3_7: 0015_Processor - MEMORY (U1401.AW41), 0026_DDR5 SODIMM CONTRO (J?#1.91)
DDR5_C1_0_DQ4_0: 0015_Processor - MEMORY (U1401.AY39), 0026_DDR5 SODIMM CONTRO (J?#1.103)
DDR5_C1_0_DQ4_1: 0015_Processor - MEMORY (U1401.AV39), 0026_DDR5 SODIMM CONTRO (J?#1.99)
DDR5_C1_0_DQ4_2: 0015_Processor - MEMORY (U1401.BA39), 0026_DDR5 SODIMM CONTRO (J?#1.95)
DDR5_C1_0_DQ4_3: 0015_Processor - MEMORY (U1401.AW39), 0026_DDR5 SODIMM CONTRO (J?#1.96)
DDR5_C1_0_DQS0_DN: 0015_Processor - MEMORY (U1401.AL47), 0026_DDR5 SODIMM CONTRO (J?#1.20)
DDR5_C1_0_DQS0_DP: 0015_Processor - MEMORY (U1401.AM47), 0026_DDR5 SODIMM CONTRO (J?#1.22)
DDR5_C1_0_DQS1_DN: 0015_Processor - MEMORY (U1401.AR46), 0026_DDR5 SODIMM CONTRO (J?#1.39)
DDR5_C1_0_DQS1_DP: 0015_Processor - MEMORY (U1401.AT46), 0026_DDR5 SODIMM CONTRO (J?#1.41)
DDR5_C1_0_DQS2_DN: 0015_Processor - MEMORY (U1401.AW48), 0026_DDR5 SODIMM CONTRO (J?#1.62)
DDR5_C1_0_DQS2_DP: 0015_Processor - MEMORY (U1401.AW47), 0026_DDR5 SODIMM CONTRO (J?#1.64)
DDR5_C1_0_DQS3_DN: 0015_Processor - MEMORY (U1401.AW43), 0026_DDR5 SODIMM CONTRO (J?#1.81)
DDR5_C1_0_DQS3_DP: 0015_Processor - MEMORY (U1401.AW42), 0026_DDR5 SODIMM CONTRO (J?#1.83)
DDR5_C1_0_DQS4_DN: 0015_Processor - MEMORY (U1401.AV38), 0026_DDR5 SODIMM CONTRO (J?#1.100)
DDR5_C1_0_DQS4_DP: 0015_Processor - MEMORY (U1401.AV37), 0026_DDR5 SODIMM CONTRO (J?#1.102)
DDR5_C1_1_CA0: 0015_Processor - MEMORY (U1401.AW23), 0026_DDR5 SODIMM CONTRO (J?#3.164)
DDR5_C1_1_CA1: 0015_Processor - MEMORY (U1401.AU27), 0026_DDR5 SODIMM CONTRO (J?#3.162)
DDR5_C1_1_CA2: 0015_Processor - MEMORY (U1401.AW24), 0026_DDR5 SODIMM CONTRO (J?#3.158)
DDR5_C1_1_CA3: 0015_Processor - MEMORY (U1401.BA25), 0026_DDR5 SODIMM CONTRO (J?#3.157)
DDR5_C1_1_CA4: 0015_Processor - MEMORY (U1401.BA24), 0026_DDR5 SODIMM CONTRO (J?#3.156)
DDR5_C1_1_CA5: 0015_Processor - MEMORY (U1401.AW25), 0026_DDR5 SODIMM CONTRO (J?#3.155)
DDR5_C1_1_CA6: 0015_Processor - MEMORY (U1401.AY25), 0026_DDR5 SODIMM CONTRO (J?#3.152)
DDR5_C1_1_CA7: 0015_Processor - MEMORY (U1401.AV26), 0026_DDR5 SODIMM CONTRO (J?#3.151)
DDR5_C1_1_CA8: 0015_Processor - MEMORY (U1401.BA27), 0026_DDR5 SODIMM CONTRO (J?#3.150)
DDR5_C1_1_CA9: 0015_Processor - MEMORY (U1401.BA26), 0026_DDR5 SODIMM CONTRO (J?#3.149)
DDR5_C1_1_CA10: 0015_Processor - MEMORY (U1401.AW26), 0026_DDR5 SODIMM CONTRO (J?#3.146)
DDR5_C1_1_CA11: 0015_Processor - MEMORY (U1401.AY27), 0026_DDR5 SODIMM CONTRO (J?#3.145)
DDR5_C1_1_CA12: 0015_Processor - MEMORY (U1401.AW27), 0026_DDR5 SODIMM CONTRO (J?#3.144)
DDR5_C1_1_CK2_DN: 0015_Processor - MEMORY (U1401.AV22), 0026_DDR5 SODIMM CONTRO (J?#3.139)
DDR5_C1_1_CK2_DP: 0015_Processor - MEMORY (U1401.AU22), 0026_DDR5 SODIMM CONTRO (J?#3.137)
DDR5_C1_1_CK3_DN: 0015_Processor - MEMORY (U1401.AT22), 0026_DDR5 SODIMM CONTRO (J?#3.140)
DDR5_C1_1_CK3_DP: 0015_Processor - MEMORY (U1401.AT23), 0026_DDR5 SODIMM CONTRO (J?#3.138)
DDR5_C1_1_CS2_N: 0015_Processor - MEMORY (U1401.AY21), 0026_DDR5 SODIMM CONTRO (J?#3.161)
DDR5_C1_1_CS3_N: 0015_Processor - MEMORY (U1401.AW21), 0026_DDR5 SODIMM CONTRO (J?#3.165)
DDR5_C1_1_DQ0_0: 0015_Processor - MEMORY (U1401.AV16), 0026_DDR5 SODIMM CONTRO (J?#3.180)
DDR5_C1_1_DQ0_1: 0015_Processor - MEMORY (U1401.AY17), 0026_DDR5 SODIMM CONTRO (J?#3.179)
DDR5_C1_1_DQ0_2: 0015_Processor - MEMORY (U1401.AV17), 0026_DDR5 SODIMM CONTRO (J?#3.184)
DDR5_C1_1_DQ0_3: 0015_Processor - MEMORY (U1401.AW17), 0026_DDR5 SODIMM CONTRO (J?#3.183)
DDR5_C1_1_DQ0_4: 0015_Processor - MEMORY (U1401.AV15), 0026_DDR5 SODIMM CONTRO (J?#3.194)
DDR5_C1_1_DQ0_5: 0015_Processor - MEMORY (U1401.AW15), 0026_DDR5 SODIMM CONTRO (J?#3.191)
DDR5_C1_1_DQ0_6: 0015_Processor - MEMORY (U1401.AY15), 0026_DDR5 SODIMM CONTRO (J?#3.198)
DDR5_C1_1_DQ0_7: 0015_Processor - MEMORY (U1401.BA15), 0026_DDR5 SODIMM CONTRO (J?#3.195)
DDR5_C1_1_DQ1_0: 0015_Processor - MEMORY (U1401.BA12), 0026_DDR5 SODIMM CONTRO (J?#3.202)
DDR5_C1_1_DQ1_1: 0015_Processor - MEMORY (U1401.BA13), 0026_DDR5 SODIMM CONTRO (J?#3.199)
DDR5_C1_1_DQ1_2: 0015_Processor - MEMORY (U1401.AY13), 0026_DDR5 SODIMM CONTRO (J?#3.206)
DDR5_C1_1_DQ1_3: 0015_Processor - MEMORY (U1401.AW13), 0026_DDR5 SODIMM CONTRO (J?#3.203)
DDR5_C1_1_DQ1_4: 0015_Processor - MEMORY (U1401.BA11), 0026_DDR5 SODIMM CONTRO (J?#3.214)
DDR5_C1_1_DQ1_5: 0015_Processor - MEMORY (U1401.AY10), 0026_DDR5 SODIMM CONTRO (J?#3.213)
DDR5_C1_1_DQ1_6: 0015_Processor - MEMORY (U1401.AW10), 0026_DDR5 SODIMM CONTRO (J?#3.218)
DDR5_C1_1_DQ1_7: 0015_Processor - MEMORY (U1401.BA10), 0026_DDR5 SODIMM CONTRO (J?#3.217)
DDR5_C1_1_DQ2_0: 0015_Processor - MEMORY (U1401.BA7), 0026_DDR5 SODIMM CONTRO (J?#3.222)
DDR5_C1_1_DQ2_1: 0015_Processor - MEMORY (U1401.BA8), 0026_DDR5 SODIMM CONTRO (J?#3.221)
DDR5_C1_1_DQ2_2: 0015_Processor - MEMORY (U1401.AW8), 0026_DDR5 SODIMM CONTRO (J?#3.226)
DDR5_C1_1_DQ2_3: 0015_Processor - MEMORY (U1401.AY8), 0026_DDR5 SODIMM CONTRO (J?#3.225)
DDR5_C1_1_DQ2_4: 0015_Processor - MEMORY (U1401.AV7), 0026_DDR5 SODIMM CONTRO (J?#3.236)
DDR5_C1_1_DQ2_5: 0015_Processor - MEMORY (U1401.AV6), 0026_DDR5 SODIMM CONTRO (J?#3.233)
DDR5_C1_1_DQ2_6: 0015_Processor - MEMORY (U1401.AW6), 0026_DDR5 SODIMM CONTRO (J?#3.240)
DDR5_C1_1_DQ2_7: 0015_Processor - MEMORY (U1401.AV8), 0026_DDR5 SODIMM CONTRO (J?#3.237)
DDR5_C1_1_DQ3_0: 0015_Processor - MEMORY (U1401.AT6), 0026_DDR5 SODIMM CONTRO (J?#3.244)
DDR5_C1_1_DQ3_1: 0015_Processor - MEMORY (U1401.AT8), 0026_DDR5 SODIMM CONTRO (J?#3.241)
DDR5_C1_1_DQ3_2: 0015_Processor - MEMORY (U1401.AR6), 0026_DDR5 SODIMM CONTRO (J?#3.248)
DDR5_C1_1_DQ3_3: 0015_Processor - MEMORY (U1401.AT7), 0026_DDR5 SODIMM CONTRO (J?#3.245)
DDR5_C1_1_DQ3_4: 0015_Processor - MEMORY (U1401.AP6), 0026_DDR5 SODIMM CONTRO (J?#3.256)
DDR5_C1_1_DQ3_5: 0015_Processor - MEMORY (U1401.AN6), 0026_DDR5 SODIMM CONTRO (J?#3.255)
DDR5_C1_1_DQ3_6: 0015_Processor - MEMORY (U1401.AN8), 0026_DDR5 SODIMM CONTRO (J?#3.260)
DDR5_C1_1_DQ3_7: 0015_Processor - MEMORY (U1401.AN7), 0026_DDR5 SODIMM CONTRO (J?#3.259)
DDR5_C1_1_DQ4_0: 0015_Processor - MEMORY (U1401.AW19), 0026_DDR5 SODIMM CONTRO (J?#3.175)
DDR5_C1_1_DQ4_1: 0015_Processor - MEMORY (U1401.AV19), 0026_DDR5 SODIMM CONTRO (J?#3.176)
DDR5_C1_1_DQ4_2: 0015_Processor - MEMORY (U1401.AY19), 0026_DDR5 SODIMM CONTRO (J?#3.168)
DDR5_C1_1_DQ4_3: 0015_Processor - MEMORY (U1401.BA19), 0026_DDR5 SODIMM CONTRO (J?#3.172)
DDR5_C1_1_DQS0_DN: 0015_Processor - MEMORY (U1401.BA17), 0026_DDR5 SODIMM CONTRO (J?#3.188)
DDR5_C1_1_DQS0_DP: 0015_Processor - MEMORY (U1401.BA16), 0026_DDR5 SODIMM CONTRO (J?#3.190)
DDR5_C1_1_DQS1_DN: 0015_Processor - MEMORY (U1401.AW12), 0026_DDR5 SODIMM CONTRO (J?#3.207)
DDR5_C1_1_DQS1_DP: 0015_Processor - MEMORY (U1401.AW11), 0026_DDR5 SODIMM CONTRO (J?#3.209)
DDR5_C1_1_DQS2_DN: 0015_Processor - MEMORY (U1401.BA6), 0026_DDR5 SODIMM CONTRO (J?#3.230)
DDR5_C1_1_DQS2_DP: 0015_Processor - MEMORY (U1401.AY6), 0026_DDR5 SODIMM CONTRO (J?#3.232)
DDR5_C1_1_DQS3_DN: 0015_Processor - MEMORY (U1401.AR8), 0026_DDR5 SODIMM CONTRO (J?#3.249)
DDR5_C1_1_DQS3_DP: 0015_Processor - MEMORY (U1401.AP8), 0026_DDR5 SODIMM CONTRO (J?#3.251)
DDR5_C1_1_DQS4_DN: 0015_Processor - MEMORY (U1401.AU20), 0026_DDR5 SODIMM CONTRO (J?#3.169)
DDR5_C1_1_DQS4_DP: 0015_Processor - MEMORY (U1401.AU19), 0026_DDR5 SODIMM CONTRO (J?#3.171)
DDR5_C1_ALERT_N: 0015_Processor - MEMORY (U1401.AT27), 0026_DDR5 SODIMM CONTRO (R?#52.2)
DDR5_PWR_EN: 0024_DDR5 SODIMM CONTRO (J2301.8), 0026_DDR5 SODIMM CONTRO (J?#2.8)
DDR5_PWR_GOOD: 0024_DDR5 SODIMM CONTRO (J2301.7), 0026_DDR5 SODIMM CONTRO (J?#2.7)
DDR5_RESET_N: 0024_DDR5 SODIMM CONTRO (C?#81.1 J2301.163 R?#48.1 R?#49.2), 0026_DDR5 SODIMM CONTRO (C?#83.1 J?#2.163)
DG_PLI_SW: 0052_PCIe_X16 (J?#5.A8 R?#272.2), 0053_PCIE GEN5_MISC (SW?#3.6)
DMI_IT_MR_0_DN: 0012_Processor - PEG, D (R?#31.1), 0036_PCH_DMI (U23601.A51)
DMI_IT_MR_0_DP: 0012_Processor - PEG, D (R?#29.1), 0036_PCH_DMI (U23601.B50)
DMI_IT_MR_1_DN: 0012_Processor - PEG, D (R?#27.1), 0036_PCH_DMI (U23601.B49)
DMI_IT_MR_1_DP: 0012_Processor - PEG, D (R?#25.1), 0036_PCH_DMI (U23601.A49)
DMI_IT_MR_2_DN: 0012_Processor - PEG, D (R?#23.1), 0036_PCH_DMI (U23601.D48)
DMI_IT_MR_2_DP: 0012_Processor - PEG, D (R?#21.1), 0036_PCH_DMI (U23601.C48)
DMI_IT_MR_3_DN: 0012_Processor - PEG, D (R?#19.1), 0036_PCH_DMI (U23601.D47)
DMI_IT_MR_3_DP: 0012_Processor - PEG, D (R?#17.1), 0036_PCH_DMI (U23601.C47)
DMI_IT_MR_4_DN: 0012_Processor - PEG, D (R?#15.1), 0036_PCH_DMI (U23601.A45)
DMI_IT_MR_4_DP: 0012_Processor - PEG, D (R?#13.1), 0036_PCH_DMI (U23601.B45)
DMI_IT_MR_5_DN: 0012_Processor - PEG, D (R?#11.1), 0036_PCH_DMI (U23601.C44)
DMI_IT_MR_5_DP: 0012_Processor - PEG, D (R?#9.1), 0036_PCH_DMI (U23601.D44)
DMI_IT_MR_6_DN: 0012_Processor - PEG, D (R?#7.1), 0036_PCH_DMI (U23601.D43)
DMI_IT_MR_6_DP: 0012_Processor - PEG, D (R?#5.1), 0036_PCH_DMI (U23601.C42)
DMI_IT_MR_7_DN: 0012_Processor - PEG, D (R?#3.1), 0036_PCH_DMI (U23601.C41)
DMI_IT_MR_7_DP: 0012_Processor - PEG, D (R?#1.1), 0036_PCH_DMI (U23601.B41)
DMI_MT_IR_0_DN: 0012_Processor - PEG, D (R?#32.2), 0036_PCH_DMI (U23601.D49)
DMI_MT_IR_0_DP: 0012_Processor - PEG, D (R?#30.2), 0036_PCH_DMI (U23601.E50)
DMI_MT_IR_1_DN: 0012_Processor - PEG, D (R?#28.2), 0036_PCH_DMI (U23601.G46)
DMI_MT_IR_1_DP: 0012_Processor - PEG, D (R?#26.2), 0036_PCH_DMI (U23601.G47)
DMI_MT_IR_2_DN: 0012_Processor - PEG, D (R?#24.2), 0036_PCH_DMI (U23601.H43)
DMI_MT_IR_2_DP: 0012_Processor - PEG, D (R?#22.2), 0036_PCH_DMI (U23601.F44)
DMI_MT_IR_3_DN: 0012_Processor - PEG, D (R?#20.2), 0036_PCH_DMI (U23601.F42)
DMI_MT_IR_3_DP: 0012_Processor - PEG, D (R?#18.2), 0036_PCH_DMI (U23601.H41)
DMI_MT_IR_4_DN: 0012_Processor - PEG, D (R?#16.2), 0036_PCH_DMI (U23601.K40)
DMI_MT_IR_4_DP: 0012_Processor - PEG, D (R?#14.2), 0036_PCH_DMI (U23601.J40)
DMI_MT_IR_5_DN: 0012_Processor - PEG, D (R?#12.2), 0036_PCH_DMI (U23601.H38)
DMI_MT_IR_5_DP: 0012_Processor - PEG, D (R?#10.2), 0036_PCH_DMI (U23601.F39)
DMI_MT_IR_6_DN: 0012_Processor - PEG, D (R?#8.2), 0036_PCH_DMI (U23601.J38)
DMI_MT_IR_6_DP: 0012_Processor - PEG, D (R?#6.2), 0036_PCH_DMI (U23601.L37)
DMI_MT_IR_7_DN: 0012_Processor - PEG, D (R?#4.2), 0036_PCH_DMI (U23601.F36)
DMI_MT_IR_7_DP: 0012_Processor - PEG, D (R?#2.2), 0036_PCH_DMI (U23601.H36)
DRAM_CLK: 0024_DDR5 SODIMM CONTRO (J2301.4 R?#43.1), 0026_DDR5 SODIMM CONTRO (J?#2.4)
DRAM_DATA: 0024_DDR5 SODIMM CONTRO (J2301.6 R?#44.1), 0026_DDR5 SODIMM CONTRO (J?#2.6)
EXP_A_RX_0_DN: 0012_Processor - PEG, D (U1401.C20), 0052_PCIe_X16 (J?#5.A17)
EXP_A_RX_0_DP: 0012_Processor - PEG, D (U1401.B20), 0052_PCIe_X16 (J?#5.A16)
EXP_A_RX_1_DN: 0012_Processor - PEG, D (U1401.C18), 0052_PCIe_X16 (J?#5.A22)
EXP_A_RX_1_DP: 0012_Processor - PEG, D (U1401.B18), 0052_PCIe_X16 (J?#5.A21)
EXP_A_RX_2_DN: 0012_Processor - PEG, D (U1401.C16), 0052_PCIe_X16 (J?#5.A26)
EXP_A_RX_2_DP: 0012_Processor - PEG, D (U1401.B16), 0052_PCIe_X16 (J?#5.A25)
EXP_A_RX_3_DN: 0012_Processor - PEG, D (U1401.C14), 0052_PCIe_X16 (J?#5.A30)
EXP_A_RX_3_DP: 0012_Processor - PEG, D (U1401.B14), 0052_PCIe_X16 (J?#5.A29)
EXP_A_RX_4_DN: 0012_Processor - PEG, D (U1401.C12), 0052_PCIe_X16 (J?#5.A36)
EXP_A_RX_5_DN: 0012_Processor - PEG, D (U1401.C10), 0052_PCIe_X16 (J?#5.A40)
EXP_A_RX_6_DN: 0012_Processor - PEG, D (U1401.C8), 0052_PCIe_X16 (J?#5.A44)
EXP_A_RX_6_DP: 0012_Processor - PEG, D (U1401.B8), 0052_PCIe_X16 (J?#5.A43)
EXP_A_RX_7_DN: 0012_Processor - PEG, D (U1401.D3), 0052_PCIe_X16 (J?#5.A48)
EXP_A_RX_7_DP: 0012_Processor - PEG, D (U1401.D2), 0052_PCIe_X16 (J?#5.A47)
EXP_A_RX_8_DN: 0012_Processor - PEG, D (U1401.F3), 0052_PCIe_X16 (J?#5.A53)
EXP_A_RX_8_DP: 0012_Processor - PEG, D (U1401.F2), 0052_PCIe_X16 (J?#5.A52)
EXP_A_RX_9_DN: 0012_Processor - PEG, D (U1401.H3), 0052_PCIe_X16 (J?#5.A57)
EXP_A_RX_9_DP: 0012_Processor - PEG, D (U1401.H2), 0052_PCIe_X16 (J?#5.A56)
EXP_A_RX_10_DN: 0012_Processor - PEG, D (U1401.K3), 0052_PCIe_X16 (J?#5.A61)
EXP_A_RX_10_DP: 0012_Processor - PEG, D (U1401.K2), 0052_PCIe_X16 (J?#5.A60)
EXP_A_RX_11_DN: 0012_Processor - PEG, D (U1401.M3), 0052_PCIe_X16 (J?#5.A65)
EXP_A_RX_11_DP: 0012_Processor - PEG, D (U1401.M2), 0052_PCIe_X16 (J?#5.A64)
EXP_A_RX_12_DN: 0012_Processor - PEG, D (U1401.P3), 0052_PCIe_X16 (J?#5.A69)
EXP_A_RX_12_DP: 0012_Processor - PEG, D (U1401.P2), 0052_PCIe_X16 (J?#5.A68)
EXP_A_RX_13_DN: 0012_Processor - PEG, D (U1401.T3), 0052_PCIe_X16 (J?#5.A73)
EXP_A_RX_13_DP: 0012_Processor - PEG, D (U1401.T2), 0052_PCIe_X16 (J?#5.A72)
EXP_A_RX_14_DN: 0012_Processor - PEG, D (U1401.V3), 0052_PCIe_X16 (J?#5.A77)
EXP_A_RX_14_DP: 0012_Processor - PEG, D (U1401.V2), 0052_PCIe_X16 (J?#5.A76)
EXP_A_RX_15_DN: 0012_Processor - PEG, D (U1401.Y3), 0052_PCIe_X16 (J?#5.A81)
EXP_A_RX_15_DP: 0012_Processor - PEG, D (U1401.Y2), 0052_PCIe_X16 (J?#5.A80)
EXP_A_TX_0_DN: 0012_Processor - PEG, D (U1401.F21), 0052_PCIe_X16 (C?#112.1)
EXP_A_TX_0_DP: 0012_Processor - PEG, D (U1401.E21), 0052_PCIe_X16 (C?#111.1)
EXP_A_TX_1_DN: 0012_Processor - PEG, D (U1401.F19), 0052_PCIe_X16 (C?#114.1)
EXP_A_TX_1_DP: 0012_Processor - PEG, D (U1401.E19), 0052_PCIe_X16 (C?#113.1)
EXP_A_TX_2_DN: 0012_Processor - PEG, D (U1401.F17), 0052_PCIe_X16 (C?#116.1 C?#116.2 J?#5.B24)
EXP_A_TX_2_DP: 0012_Processor - PEG, D (U1401.E17), 0052_PCIe_X16 (C?#115.1 C?#115.2 J?#5.B23)
EXP_A_TX_3_DN: 0012_Processor - PEG, D (U1401.F15), 0052_PCIe_X16 (C?#120.1)
EXP_A_TX_3_DP: 0012_Processor - PEG, D (U1401.E15), 0052_PCIe_X16 (C?#119.1)
EXP_A_TX_4_DN: 0012_Processor - PEG, D (U1401.F13), 0052_PCIe_X16 (C?#122.1)
EXP_A_TX_4_DP: 0012_Processor - PEG, D (U1401.E13), 0052_PCIe_X16 (C?#121.1)
EXP_A_TX_5_DN: 0012_Processor - PEG, D (U1401.F11), 0052_PCIe_X16 (C?#127.1)
EXP_A_TX_5_DP: 0012_Processor - PEG, D (U1401.E11), 0052_PCIe_X16 (C?#124.1)
EXP_A_TX_6_DN: 0012_Processor - PEG, D (U1401.F9), 0052_PCIe_X16 (C?#129.1)
EXP_A_TX_6_DP: 0012_Processor - PEG, D (U1401.E9), 0052_PCIe_X16 (C?#128.1)
EXP_A_TX_7_DN: 0012_Processor - PEG, D (U1401.E7), 0052_PCIe_X16 (C?#131.1)
EXP_A_TX_7_DP: 0012_Processor - PEG, D (U1401.E6), 0052_PCIe_X16 (C?#130.1)
EXP_A_TX_8_DN: 0012_Processor - PEG, D (U1401.G6), 0052_PCIe_X16 (C?#133.1)
EXP_A_TX_8_DP: 0012_Processor - PEG, D (U1401.G5), 0052_PCIe_X16 (C?#132.1)
EXP_A_TX_9_DN: 0012_Processor - PEG, D (U1401.J6), 0052_PCIe_X16 (C?#135.1)
EXP_A_TX_9_DP: 0012_Processor - PEG, D (U1401.J5), 0052_PCIe_X16 (C?#134.1)
EXP_A_TX_10_DN: 0012_Processor - PEG, D (U1401.L6), 0052_PCIe_X16 (C?#137.1)
EXP_A_TX_10_DP: 0012_Processor - PEG, D (U1401.L5), 0052_PCIe_X16 (C?#136.1)
EXP_A_TX_11_DN: 0012_Processor - PEG, D (U1401.N6), 0052_PCIe_X16 (C?#139.1)
EXP_A_TX_11_DP: 0012_Processor - PEG, D (U1401.N5), 0052_PCIe_X16 (C?#138.1)
EXP_A_TX_12_DN: 0012_Processor - PEG, D (U1401.R6), 0052_PCIe_X16 (C?#141.1)
EXP_A_TX_12_DP: 0012_Processor - PEG, D (U1401.R5), 0052_PCIe_X16 (C?#140.1)
EXP_A_TX_13_DN: 0012_Processor - PEG, D (U1401.U6), 0052_PCIe_X16 (C?#143.1)
EXP_A_TX_13_DP: 0012_Processor - PEG, D (U1401.U5), 0052_PCIe_X16 (C?#142.1)
EXP_A_TX_14_DN: 0012_Processor - PEG, D (U1401.W6), 0052_PCIe_X16 (C?#145.1)
EXP_A_TX_14_DP: 0012_Processor - PEG, D (U1401.W5), 0052_PCIe_X16 (C?#144.1)
EXP_A_TX_15_DN: 0012_Processor - PEG, D (U1401.AA6), 0052_PCIe_X16 (C?#147.1)
EXP_A_TX_15_DP: 0012_Processor - PEG, D (U1401.AA5), 0052_PCIe_X16 (C?#146.1)
GPIO_PEG_RST_N: 0043_GPP_MUX_E (R?#166.1 R?#167.1 R?#168.2), 0096_CONNECTIVITY - FOX (R?#430.1 R?#435.1 U?#10.2)
GPP_C_0_SMBCLK: 0039_GPP_C_D_E (U23601.AE53), 0052_PCIe_X16 (R?#262.1)
GPP_C_1_SMBDATA: 0039_GPP_C_D_E (U23601.AE54), 0052_PCIe_X16 (R?#263.1)
GPP_C_2_SMBALERT_N: 0039_GPP_C_D_E (U23601.AD53), 0045_PCH STRAPS 1 (R?#190.1 R?#194.2)
GPP_C_5_SML0ALERT_N: 0039_GPP_C_D_E (U23601.AB41), 0045_PCH STRAPS 1 (R?#198.1 R?#201.2)
GPP_C_6_ISH_I2C2_SDA_I2C3_SDA: 0039_GPP_C_D_E (U23601.AD47), 0063_HDMI1_CONNECTOR (Q?#8.2 R?#344.1)
GPP_C_7_ISH_I2C2_SCL_I2C3_SCL: 0039_GPP_C_D_E (U23601.AD45), 0063_HDMI1_CONNECTOR (C?#193.1 Q?#9.2 R?#348.1)
GPP_C_20_UART2_RXD_CNV_MFUART0_RXD: 0029_System_debug_conne (J?#4.40 R?#54.1), 0039_GPP_C_D_E (U23601.AF50)
GPP_C_21_UART2_TXD_CNV_MFUART0_TXD: 0029_System_debug_conne (J?#4.38 R?#55.1), 0039_GPP_C_D_E (U23601.AG52)
GPP_E_0_SATAXPCIE_0_SATAGP_0: 0039_GPP_C_D_E (U23601.BB53), 0043_GPP_MUX_E (R?#165.1)
GPP_E_2_SATAXPCIE_2_SATAGP_2: 0039_GPP_C_D_E (U23601.AY40), 0043_GPP_MUX_E (R?#168.1)
GPP_E_4_SATA_DEVSLP_0: 0039_GPP_C_D_E (U23601.BD52), 0043_GPP_MUX_E (R?#169.1), 0052_PCIe_X16 (R?#264.1)
GPP_E_5_SATA_DEVSLP_1: 0039_GPP_C_D_E (U23601.BA47), 0043_GPP_MUX_E (R?#171.1 R?#172.1)
GPP_E_6_SATA_DEVSLP_2: 0039_GPP_C_D_E (U23601.BC52), 0052_PCIe_X16 (R?#265.1)
GPP_E_10_USB2_OCB_1: 0039_GPP_C_D_E (U23601.BA43), 0043_GPP_MUX_E (C?#98.1 R?#157.1 R?#158.1)
GPP_E_11_USB2_OCB_2_GMII_MDC_1: 0039_GPP_C_D_E (U23601.BG51), 0043_GPP_MUX_E (C?#100.1 R?#162.1 R?#163.1)
GPP_E_12_USB2_OCB_3_GMII_MDIO_1: 0039_GPP_C_D_E (U23601.BC47), 0043_GPP_MUX_E (C?#99.2 R?#159.1 R?#160.1 R?#161.1), 0052_PCIe_X16 (C?#148.2 R?#274.1 R?#275.1 R?#277.1)
GPP_E_15_SPI1_MISO_IO_1_THC0_SPI1_IO_1: 0039_GPP_C_D_E (U23601.BF49), 0043_GPP_MUX_E (R?#164.1), 0052_PCIe_X16 (R?#271.1)
GPP_E_18_SPI1_IO_3_THC0_SPI1_IO_3: 0039_GPP_C_D_E (U23601.BE49), 0043_GPP_MUX_E (R?#173.1)
GPP_I_2_DDSP_HPD_2_DISP_MISC_2: 0040_GPP_I_J_K_R_S (U23601.BD14), 0062_HDMI0_CONNECTOR  (Q?#3.3 R?#318.1)
GPP_I_3_DDSP_HPD_3_DISP_MISC_3: 0040_GPP_I_J_K_R_S (U23601.BA13), 0063_HDMI1_CONNECTOR (Q?#7.3 R?#341.1)
GPP_I_11_USB2_OCB_4_I2C4_SDA: 0040_GPP_I_J_K_R_S (U23601.BA16), 0062_HDMI0_CONNECTOR  (5 pins)
GPP_I_18_GSPI0_MOSI: 0040_GPP_I_J_K_R_S (U23601.BE12), 0045_PCH STRAPS 1 (R?#185.1 R?#188.2)
GPP_I_22_GSPI1_MOSI: 0040_GPP_I_J_K_R_S (U23601.BG15), 0046_PCH STRAPS 2 (R?#212.1 R?#214.2)
GPP_J_1_CPU_C10_GATE_N: 0040_GPP_I_J_K_R_S (U23601.BA3), 0049_GLITCH FREE CIRCUI (R?#235.1 R?#237.2)
GPP_J_2_CNV_BRI_DT_UART0_RTS_N: 0040_GPP_I_J_K_R_S (U23601.AU6), 0046_PCH STRAPS 2 (R?#206.1 R?#207.2)
GPP_J_4_CNV_RGI_DT_UART0_TXD: 0040_GPP_I_J_K_R_S (U23601.BC5), 0045_PCH STRAPS 1 (R?#199.1 R?#202.2)
GPP_K_3_GSXSRESET_N: 0040_GPP_I_J_K_R_S (U23601.BA51), 0052_PCIe_X16 (R?#269.1)
GPP_R_9_DDSP_HPD_A_DISP_MISC_A: 0040_GPP_I_J_K_R_S (U23601.BD3), 0054_eDP_CONNECTOR (Q?#1.2 R?#291.1 R?#293.1)
H_PROCHOT_DG2_N: 0052_PCIe_X16 (R?#270.1), 0053_PCIE GEN5_MISC (R?#282.1)
H_PROCHOT_N: 0016_Processor - PM , C (CR1601.2 R1601.2 R1605.2 R1607.1), 0074_S0IX_REQ_ACK_OPTIO (CR7401.2)
HDA_RSTB: 0040_GPP_I_J_K_R_S (U23601.BE7), 0049_GLITCH FREE CIRCUI (R?#241.2)
ITP_PMODE: 0029_System_debug_conne (J?#4.18 R?#57.1), 0045_PCH STRAPS 1 (R?#205.2)
L_BKLTEN: 0049_GLITCH FREE CIRCUI (R?#246.2), 0054_eDP_CONNECTOR (J?#6.32 R?#286.1 R?#289.2)
LAN_MDI1_DN: 0095_GBIT LAN - FOXVILLE LAN PHY CHIP (U?#7.46), 0096_CONNECTIVITY - FOX (U?#9.57)
LAN_MDI1_DP: 0095_GBIT LAN - FOXVILLE LAN PHY CHIP (U?#7.45), 0096_CONNECTIVITY - FOX (U?#9.56)
LAN_MDI2_DN: 0095_GBIT LAN - FOXVILLE LAN PHY CHIP (U?#7.49), 0096_CONNECTIVITY - FOX (U?#9.60)
LAN_MDI2_DP: 0095_GBIT LAN - FOXVILLE LAN PHY CHIP (U?#7.48), 0096_CONNECTIVITY - FOX (U?#9.59)
LAN_MDI3_DN: 0095_GBIT LAN - FOXVILLE LAN PHY CHIP (U?#7.52), 0096_CONNECTIVITY - FOX (U?#9.63)
LAN_MDI3_DP: 0095_GBIT LAN - FOXVILLE LAN PHY CHIP (U?#7.51), 0096_CONNECTIVITY - FOX (U?#9.62)
LAN_MDI4_DN: 0095_GBIT LAN - FOXVILLE LAN PHY CHIP (U?#7.55), 0096_CONNECTIVITY - FOX (U?#9.66)
LAN_MDI4_DP: 0095_GBIT LAN - FOXVILLE LAN PHY CHIP (U?#7.54), 0096_CONNECTIVITY - FOX (U?#9.65)
M.2_BTWIFI_SUS_CLK: 0017_Processor - MISC (R?#35.2), 0093_M.2 KEY-E WLAN-BT (J?#11.50)
PCH_RTCRST_PULLUP: 0029_System_debug_conne (J?#4.47), 0047_PCH VALIDATION (C?#101.2 R?#224.1)
PCH_SRTCRST_N: 0029_System_debug_conne (J?#4.45), 0047_PCH VALIDATION (C?#102.2 R?#227.1)
PCH_THERMTRIP_N: 0052_PCIe_X16 (R?#273.1), 0053_PCIE GEN5_MISC (R?#279.1)
PCH_WAKE_N: 0052_PCIe_X16 (R?#254.1), 0093_M.2 KEY-E WLAN-BT (R?#387.2)
PCIE_P9_M.2_WLAN_RX_R_DN: 0037_PCH_PCIe_SATA (U23601.BE22), 0093_M.2 KEY-E WLAN-BT (J?#11.43)
PCIE_P9_M.2_WLAN_RX_R_DP: 0037_PCH_PCIe_SATA (U23601.BD23), 0093_M.2 KEY-E WLAN-BT (J?#11.41)
PCIEX16_PRSNT2_N: 0034_PCH_CLOCK (5 pins), 0052_PCIe_X16 (J?#5.B17 J?#5.B31 J?#5.B81 SW?#1.7), 0095_GBIT LAN - FOXVILLE LAN PHY CHIP (U?#7.3)
PEG_PIM_DG2: 0052_PCIe_X16 (R?#267.1), 0053_PCIE GEN5_MISC (SW?#3.4)
PEG_PLI_N_DG2: 0052_PCIe_X16 (R?#272.1), 0053_PCIE GEN5_MISC (SW?#3.3)
PEG_RTD3_COLD_MOD_SW: 0052_PCIe_X16 (5 pins), 0053_PCIE GEN5_MISC (SW?#4.5)
PEG_SLOT_DGPU_PWR_OK: 0043_GPP_MUX_E (R?#169.2 R?#170.2), 0053_PCIE GEN5_MISC (SW?#4.1)
PEG_SLOT_DGPU_SEL_N: 0052_PCIe_X16 (R?#268.1), 0053_PCIE GEN5_MISC (R?#281.1)
PEG_SLOT_RST_N: 0052_PCIe_X16 (J?#5.A11 R?#249.1), 0096_CONNECTIVITY - FOX (R?#431.2 R?#433.2 R?#435.2)
PLTRST_N_BUF: 0029_System_debug_conne (J?#4.51), 0096_CONNECTIVITY - FOX (U?#10.1)
PM_SLP_S3_N: 0029_System_debug_conne (J?#4.44), 0049_GLITCH FREE CIRCUI (R?#239.2)
PM_SLP_S4_N: 0029_System_debug_conne (J?#4.46), 0049_GLITCH FREE CIRCUI (R?#236.2)
PROG_SPI0_CLK: 0029_System_debug_conne (J?#4.28), 0030_DEBUG_CARD_SPI_SIG (EU?#1.23)
PROG_SPI0_FLASH_0_CS_N: 0029_System_debug_conne (J?#4.26), 0030_DEBUG_CARD_SPI_SIG (EU?#1.18)
PROG_SPI0_MISO_IO_1: 0029_System_debug_conne (J?#4.30), 0030_DEBUG_CARD_SPI_SIG (EU?#1.20)
PROG_SPI0_MOSI_IO_0: 0029_System_debug_conne (J?#4.32), 0030_DEBUG_CARD_SPI_SIG (EU?#1.22)
SMB_CLK_MAIN: 0024_DDR5 SODIMM CONTRO (R?#43.2), 0029_System_debug_conne (R?#68.2)
SMB_DATA_MAIN: 0024_DDR5 SODIMM CONTRO (R?#44.2), 0029_System_debug_conne (R?#70.2)
SPI_BIOS_CLK_PCH: 0030_DEBUG_CARD_SPI_SIG (EU?#1.8), 0049_GLITCH FREE CIRCUI (R?#230.2)
SPI_BIOS_HOLD_PCH_N: 0030_DEBUG_CARD_SPI_SIG (EU?#1.13 R?#88.2), 0045_PCH STRAPS 1 (R?#186.1 R?#189.2)
SPI_BIOS_MOSI_PCH: 0030_DEBUG_CARD_SPI_SIG (EU?#1.10 R?#86.2), 0045_PCH STRAPS 1 (R?#203.1 R?#204.2)
SPI_BIOS_WP_PCH_N: 0030_DEBUG_CARD_SPI_SIG (EU?#1.15 R?#87.2), 0045_PCH STRAPS 1 (R?#191.1 R?#196.2)
SRCCLKREQ_M.2_WLAN_N: 0034_PCH_CLOCK (R?#122.1 R?#138.1), 0093_M.2 KEY-E WLAN-BT (J?#11.53 R?#388.1 R?#390.1)
TBT_0_PA_SBU1_CON: 0076_TBT_0_PA_CONNECTOR (C?#202.1 D?#28.2 J?#9.53), 0077_TBT_0_PB_CONNECTOR (C?#217.1 D?#43.2 J?#10.53)
TBT_0_PA_SBU2_CON: 0076_TBT_0_PA_CONNECTOR (C?#203.1 D?#29.2 J?#9.54), 0077_TBT_0_PB_CONNECTOR (C?#218.1 D?#44.2 J?#10.54)
USB2_BP_TYPEA_1_R_DN: 0073_HSIO MUXING -4 (R7306.2), 0083_USB3 (L4A1.1 R4A3.1)
USB2_BP_TYPEA_1_R_DP: 0073_HSIO MUXING -4 (R7305.2), 0083_USB3 (L4A1.2 R4A4.1)
USB2_OC_VRT1_N: 0043_GPP_MUX_E (R?#160.2), 0052_PCIe_X16 (R?#275.2)
USB2_P1_DN: 0029_System_debug_conne (FB?#1.1 R?#53.1), 0038_PCH_USB (U23601.C15)
USB2_P1_DP: 0029_System_debug_conne (FB?#1.2 R?#56.1), 0038_PCH_USB (U23601.D16)
USB3_BP_TYPEA_1_RX_ESD_DN: 0082_USB3 (C4A14.1 R5A34.1), 0083_USB3 (CR5A26.1 J5G4.5)
USB3_BP_TYPEA_1_RX_ESD_DP: 0082_USB3 (C4A15.1 R4A21.1), 0083_USB3 (CR4A5.1 J5G4.6)
USB3_BP_TYPEA_1_TX_CMC_DN: 0082_USB3 (C5A34.2), 0083_USB3 (L5A1.4 R5A31.2)
USB3_BP_TYPEA_1_TX_CMC_DP: 0082_USB3 (C5A33.2), 0083_USB3 (L5A1.1 R5A32.1)
USB3_VRT_TYPEA_2_RX_R_DN: 0090_USB3 (CR5U1.1 J5G2.5), 0091_USB3 (C9201.1 R9204.1)
USB3_VRT_TYPEA_2_RX_R_DP: 0090_USB3 (CR5U2.1 J5G2.6), 0091_USB3 (C9202.1 R9201.1)
USB3_VRT_TYPEA_2_TX_C_DN: 0090_USB3 (L5U1.4 R5U3.2), 0091_USB3 (C9204.2)
USB3_VRT_TYPEA_2_TX_C_DP: 0090_USB3 (L5U1.1 R5U4.1), 0091_USB3 (C9203.2)
VAL_MIPI60_PRDY_N: 0029_System_debug_conne (J?#4.23), 0032_DEGUG-JTAG (R?#117.2 R?#118.2)
VAL_MIPI60_PREQ_N: 0029_System_debug_conne (J?#4.24), 0032_DEGUG-JTAG (R?#113.2 R?#114.2)
VAL_PEG_RTD3_COLD_MOD: 0043_GPP_MUX_E (R?#164.2), 0053_PCIE GEN5_MISC (SW?#4.4)
WLAN_PEWAKE_N: 0034_PCH_CLOCK (R?#121.1), 0093_M.2 KEY-E WLAN-BT (J?#11.55 R?#386.1 R?#387.1 R?#389.1)
XDP_TCLK: 0029_System_debug_conne (J?#4.14), 0031_DEBUG-XDP_SERIES_T (R?#96.1 R?#104.1)
XDP_TCLK1: 0029_System_debug_conne (J?#4.15), 0031_DEBUG-XDP_SERIES_T (R?#91.1)
XDP_TDI: 0029_System_debug_conne (J?#4.16), 0031_DEBUG-XDP_SERIES_T (R?#98.1 R?#106.1)
XDP_TDO: 0029_System_debug_conne (J?#4.20), 0031_DEBUG-XDP_SERIES_T (R?#97.1 R?#105.1)
XDP_TMS: 0029_System_debug_conne (J?#4.19), 0031_DEBUG-XDP_SERIES_T (R?#99.1 R?#107.1)
XDP_TRST_N: 0029_System_debug_conne (J?#4.17), 0031_DEBUG-XDP_SERIES_T (R?#100.1 R?#108.1)